# EAGLE design NHD-C12832A1Z_Breakout_rev2 (EAGLE 6.3)
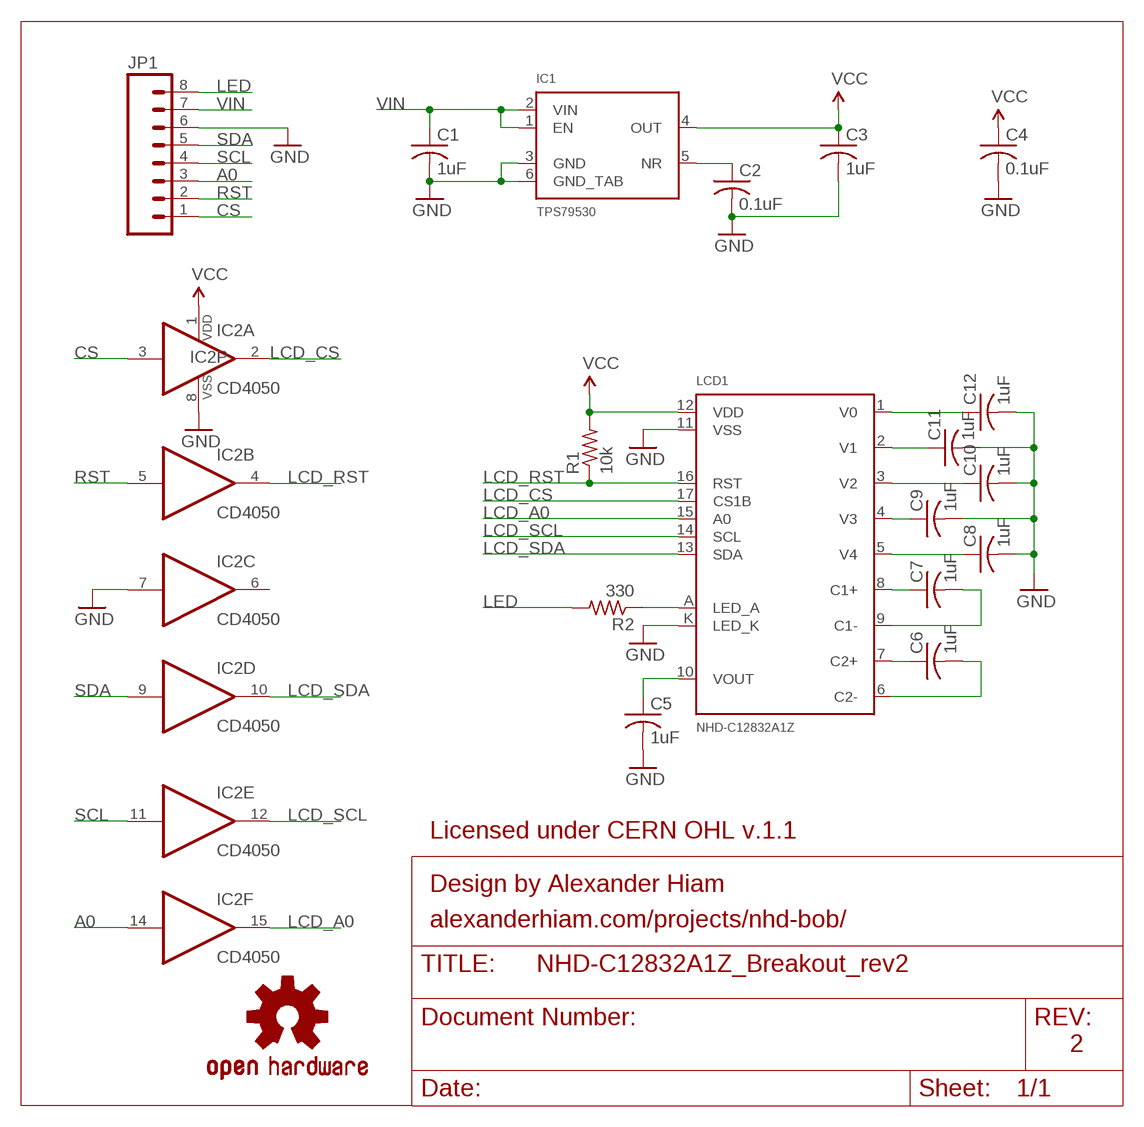
[diagram p0: schematic, sheet 1]

## Parts
C1  1uF  C-USC0603  [C0603]
C2  0.1uF  C-USC0603  [C0603]
C3  1uF  C-USC0603  [C0603]
C4  0.1uF  C-USC0603  [C0603]
C5  1uF  C-USC0603  [C0603]
C6  1uF  C-USC0603  [C0603]
C7  1uF  C-USC0603  [C0603]
C8  1uF  C-USC0603  [C0603]
C9  1uF  C-USC0603  [C0603]
C10  1uF  C-USC0603  [C0603]
C11  1uF  C-USC0603  [C0603]
C12  1uF  C-USC0603  [C0603]
IC1  TPS79530  TPS795XX  [SOT223-6]
IC2  CD4050  4050D  [SO16]
JP1  M081X08  [1X08]
LCD1  NHD-C12832A1Z  [NHD-C12832A1Z]
R1  10k  R-US_R0603  [R0603]
R2  330  R-US_R0603  [R0603]
U$1  OSHW-LOGOS  [OSHW-LOGO-S]
U$2  CERN_V1.1_LG  [CERN_V1.1_LG]

## Nets
A0: IC2.14(F:I) JP1.3
CS: IC2.3(A:I) JP1.1
GND: C1.2 C2.2 C3.2 C4.2 C5.2 C8.2 C9.2 C10.2 C11.2 C12.2 IC1.3(GND) IC1.6(GND_TAB) IC2.7(C:I) IC2.8(P:VSS) JP1.6 LCD1.11(VSS) LCD1.K(LED_K)
LCD_A0: IC2.15(F:O) LCD1.15(A0)
LCD_CS: IC2.2(A:O) LCD1.17(CS1B)
LCD_RST: IC2.4(B:O) LCD1.16(RST) R1.1
LCD_SCL: IC2.12(E:O) LCD1.14(SCL)
LCD_SDA: IC2.10(D:O) LCD1.13(SDA)
LED: JP1.8 R2.2
N$3: C2.1 IC1.5(NR)
N$12: LCD1.A(LED_A) R2.1
N$20: C5.1 LCD1.10(VOUT)
N$21: C7.1 LCD1.8(C1+)
N$22: C7.2 LCD1.9(C1-)
N$23: C6.1 LCD1.7(C2+)
N$24: C6.2 LCD1.6(C2-)
N$25: C12.1 LCD1.1(V0)
N$26: C11.1 LCD1.2(V1)
N$27: C10.1 LCD1.3(V2)
N$28: C9.1 LCD1.4(V3)
N$29: C8.1 LCD1.5(V4)
RST: IC2.5(B:I) JP1.2
SCL: IC2.11(E:I) JP1.4
SDA: IC2.9(D:I) JP1.5
VCC: C3.1 C4.1 IC1.4(OUT) IC2.1(P:VDD) LCD1.12(VDD) R1.2
VIN: C1.1 IC1.1(EN) IC1.2(VIN) JP1.7
Unconnected: IC2.6(C:O)

## Notes on the sheet
- Design by Alexander Hiam
- alexanderhiam.com/projects/nhd-bob/
- 2

## Library data of the parts
C1-C12 = rcl:C-US: CAPACITOR, American symbol
IC1 = alexanderhiam:TPS795XX
IC2 = 40xx:4050: Hex non-inverting BUFFER
JP1 = SparkFun-Connectors:M08: Header 8 Standard 8-pin 0.1" header. Use with straight break away headers (SKU : PRT-00116), right angle break away headers (PRT-00553), swiss pins (PRT-00743), machine pins (PRT-00117), and female headers (PRT-00115).
LCD1 = alexanderhiam:NHD-C12832A1Z
R1 R2 = rcl:R-US_: RESISTOR, American symbol
U$1 = SparkFun-Aesthetics:OSHW-LOGO: Open Source Hardware Logo This logo indicates the piece of hardware it is found on incorporates a OSHW license and/or adheres to the definition of open source hardware found here: http://freedomdefined.org/OSHW
U$2 = alexanderhiam:CERN_V1.1

## Board
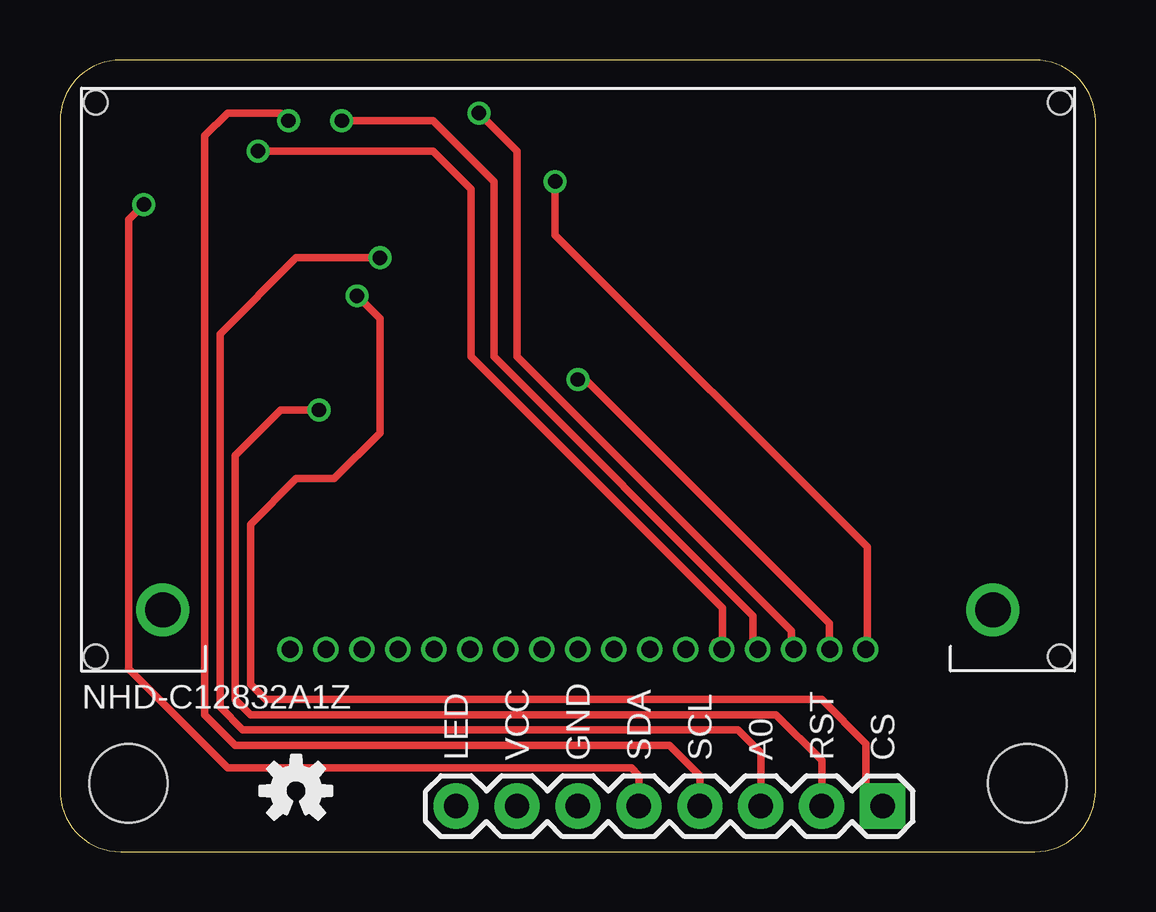
[diagram p1: board, top side]
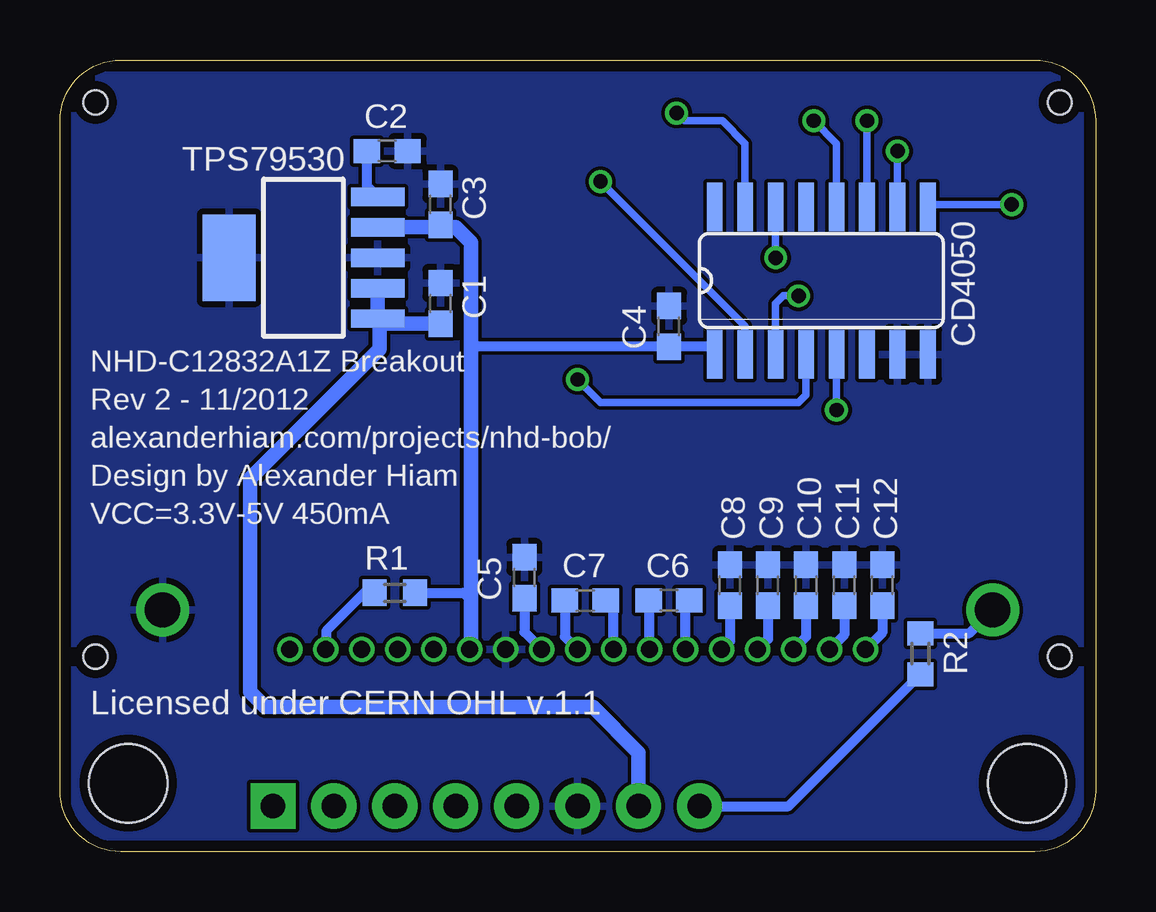
[diagram p2: board, bottom side, seen from below]

Size 43.17 x 33.01 mm. Coordinates in mm from the lower left corner, seen from the top.
Outline: 0,30.47 0,2.54 arc90 2.54,0 40.63,0 arc90 43.17,2.54 43.17,30.47 arc90 40.63,33.01 2.54,33.01 arc90 0,30.47
Copper layers (1*16): Top 0.0356mm / dielectric 1.5011mm / Bottom 0.0356mm
Design rules "LaenPCBOrder": minimum track width 6mil, minimum drill 13mil, track to track 6mil, track to pad 6mil, pad to pad 6mil, via to via 6mil, smd to smd 6mil, copper to edge 15mil, drill to drill 6mil, minimum pad ring 7mil, minimum via ring 7mil, stop-mask expansion 4mil, vias tented up to drill 0mil, thermal gap 10mil
Holes 3.26 mm at 2.86,2.86 40.32,2.86

### Footprints (pad centres in the part's own frame; a part is rotated, then mirrored left to right if it is on the bottom)
C0603 = smd 1.1 x 1: 1 -0.85,0; 2 0.85,0
SOT223-6 = smd 0.762 x 2.235: 1 -2.54,-3.099; 2 -1.27,-3.099; 3 0,-3.099; 4 1.27,-3.099; 5 2.54,-3.099 | smd 3.6 x 2.2: 6 0,3.099
SO16 = smd 0.66 x 2.032: 1 -4.445,-3.073; 2 -3.175,-3.073; 3 -1.905,-3.073; 4 -0.635,-3.073; 5 0.635,-3.073; 6 1.905,-3.073; 7 3.175,-3.073; 8 4.445,-3.073; 9 4.445,3.073; 10 3.175,3.073; 11 1.905,3.073; 12 0.635,3.073; 13 -0.635,3.073; 14 -1.905,3.073; 15 -3.175,3.073; 16 -4.445,3.073
1X08 = drill 1.016 pad 1.88 square: 1 0,0 | drill 1.016 pad 1.88: 2 2.54,0; 3 5.08,0; 4 7.62,0; 5 10.16,0; 6 12.7,0; 7 15.24,0; 8 17.78,0
NHD-C12832A1Z = drill 0.7: 1 -12,-11.25; 2 -10.5,-11.25; 3 -9,-11.25; 4 -7.5,-11.25; 5 -6,-11.25; 6 -4.5,-11.25; 7 -3,-11.25; 8 -1.5,-11.25; 9 0,-11.25; 10 1.5,-11.25; 11 3,-11.25; 12 4.5,-11.25; 13 6,-11.25; 14 7.5,-11.25; 15 9,-11.25; 16 10.5,-11.25; 17 12,-11.25 | drill 1.473: A -17.3,-9.6; K 17.3,-9.6 | hole 1: -20.1,-11.55; 20.1,-11.55; -20.1,11.55; 20.1,11.55
R0603 = smd 1 x 1.1: 1 -0.85,0; 2 0.85,0

### Placement (x,y rotation side)
C1  27.3,22.86 90 bottom
C2  29.53,29.21 0 bottom
C3  27.3,26.99 90 bottom
C4  17.78,21.91 90 bottom
C5  23.81,11.43 90 bottom
C6  17.78,10.48 0 bottom
C7  21.27,10.48 180 bottom
C8  15.24,11.11 90 bottom
C9  13.65,11.11 90 bottom
C10  12.06,11.11 90 bottom
C11  10.48,11.11 90 bottom
C12  8.89,11.11 90 bottom
IC1  33.02,24.77 90 bottom
IC2  11.43,23.81 0 bottom
JP1  34.29,1.91 180 top
LCD1  21.59,19.68 0 top
R1  29.21,10.79 0 bottom
R2  7.3,8.26 270 bottom
U$1  9.84,2.54 0 top
U$2  41.91,5.71 0 bottom

### Tracks (layer width: path | path; a pad name or v marks a point on that pad's centre or on a via)
A0  (via drill 0.6)
  Top 0.305: JP1.3 29.21,4.13 28.26,5.08 7.62,5.08 6.67,6.03 6.67,21.59 9.84,24.77 v13.34,24.77
  Bottom 0.305: v13.34,24.77 IC2.14
CS  (via drill 0.6)
  Top 0.305: v12.38,23.18 13.34,22.23 13.34,17.46 11.43,15.56 9.84,15.56 7.94,13.65 7.94,6.99 8.57,6.35 31.75,6.35 33.59,4.51 33.59,2.6 JP1.1
  Bottom 0.305: v12.38,23.18 13.02,23.18 13.34,22.86 IC2.3
GND
  pour Bottom: 0.64,32.38 42.55,32.38 42.55,0.64 0.64,0.64
LCD_A0  (via drill 0.6)
  Top 0.305: v17.46,30.8 19.05,29.21 19.05,20.64 30.48,9.21 30.48,8.54 LCD1.15
  Bottom 0.305: IC2.15 14.61,29.53 15.56,30.48 17.14,30.48 v17.46,30.8
LCD_CS  (via drill 0.6)
  Top 0.305: LCD1.17 33.66,8.5 33.66,12.7 20.64,25.72 v20.64,27.94
  Bottom 0.305: IC2.2 14.61,21.91 v20.64,27.94
LCD_RST  (via drill 0.6)
  Top 0.305: v21.59,19.68 21.91,19.68 32.07,9.53 32.07,8.46 LCD1.16
  Bottom 0.305: IC2.4 12.06,19.05 12.38,18.73 20.64,18.73 v21.59,19.68
  Bottom 0.406: R1.1 30.48,10.79 32.07,9.21 32.07,8.46 LCD1.16
LCD_SCL  (via drill 0.6)
  Top 0.305: v11.75,30.48 15.56,30.48 18.1,27.94 18.1,20.64 28.89,9.84 28.89,8.63 LCD1.14
  Bottom 0.305: IC2.12 10.79,29.53 v11.75,30.48
LCD_SDA  (via drill 0.6)
  Top 0.305: 27.3,8.72 LCD1.13 27.62,8.47 27.62,10.16 17.14,20.64 17.14,27.62 15.56,29.21 v8.26,29.21
  Bottom 0.305: IC2.10 v8.26,29.21
LED
  Bottom 0.406: JP1.8 12.8,1.91 R2.2
N$3
  Bottom 0.406: C2.1 30.38,27.76 IC1.5
N$12
  Bottom 0.406: R2.1 5.27,9.11 LCD1.A
N$20
  Bottom 0.406: C5.1 23.81,9.16 LCD1.10
N$21
  Bottom 0.406: LCD1.8 20.09,10.14 C7.1
N$22
  Bottom 0.406: C7.2 22.12,8.97 LCD1.9
N$23
  Bottom 0.406: LCD1.7 18.59,10.44 C6.1
N$24
  Bottom 0.406: LCD1.6 17.09,10.32 C6.2
N$25
  Bottom 0.406: C12.1 8.89,9.13 LCD1.1
N$26
  Bottom 0.406: C11.1 10.48,9.05 LCD1.2
N$27
  Bottom 0.406: C10.1 12.06,8.96 LCD1.3
N$28
  Bottom 0.406: C9.1 13.65,8.87 LCD1.4
N$29
  Bottom 0.406: C8.1 15.24,8.79 LCD1.5
RST  (via drill 0.6)
  Top 0.305: JP1.2 31.75,3.81 29.84,5.71 7.94,5.71 7.3,6.35 7.3,16.51 9.21,18.41 v10.79,18.41
  Bottom 0.305: v10.79,18.41 IC2.5
SCL  (via drill 0.6)
  Top 0.305: JP1.4 26.67,3.17 25.4,4.45 7.3,4.45 6.03,5.71 6.03,29.84 6.99,30.8 9.21,30.8 v9.53,30.48
  Bottom 0.305: v9.53,30.48 IC2.11
SDA  (via drill 0.6)
  Top 0.305: JP1.5 24.13,3.17 23.81,3.49 6.99,3.49 2.86,7.62 2.86,26.35 v3.49,26.99
  Bottom 0.305: v3.49,26.99 6.88,26.99 IC2.9
VCC
  Bottom 0.406: IC2.1 15.88,21.06 C4.1 25.93,21.06 26.04,20.95 | R1.2 26.35,10.79 26.04,10.48 | 26.04,8.49 LCD1.12
  Bottom 0.61: IC1.4 27.41,26.04 C3.1 27.2,26.04 26.67,26.04 26.04,25.4 26.04,20.95 26.04,10.48 26.04,8.49
VIN
  Bottom 0.61: JP1.7 19.05,4.13 20.95,6.03 34.61,6.03 35.24,6.67 35.24,15.56 29.84,20.95 29.84,22.15 IC1.1 | IC1.2 IC1.1 | C1.1 29.71,22.01 IC1.1

### Text on the board
tPlace: LED | VCC | GND | SDA | SCL | A0 | RST | CS
bPlace: NHD-C12832A1Z Breakout | Rev 2 - 11/2012 | alexanderhiam.com/projects/nhd-bob/ | Design by Alexander Hiam | VCC=3.3V-5V 450mA